# Altium schematic sheet Drone_Remote_Schematic.SchDoc
size A
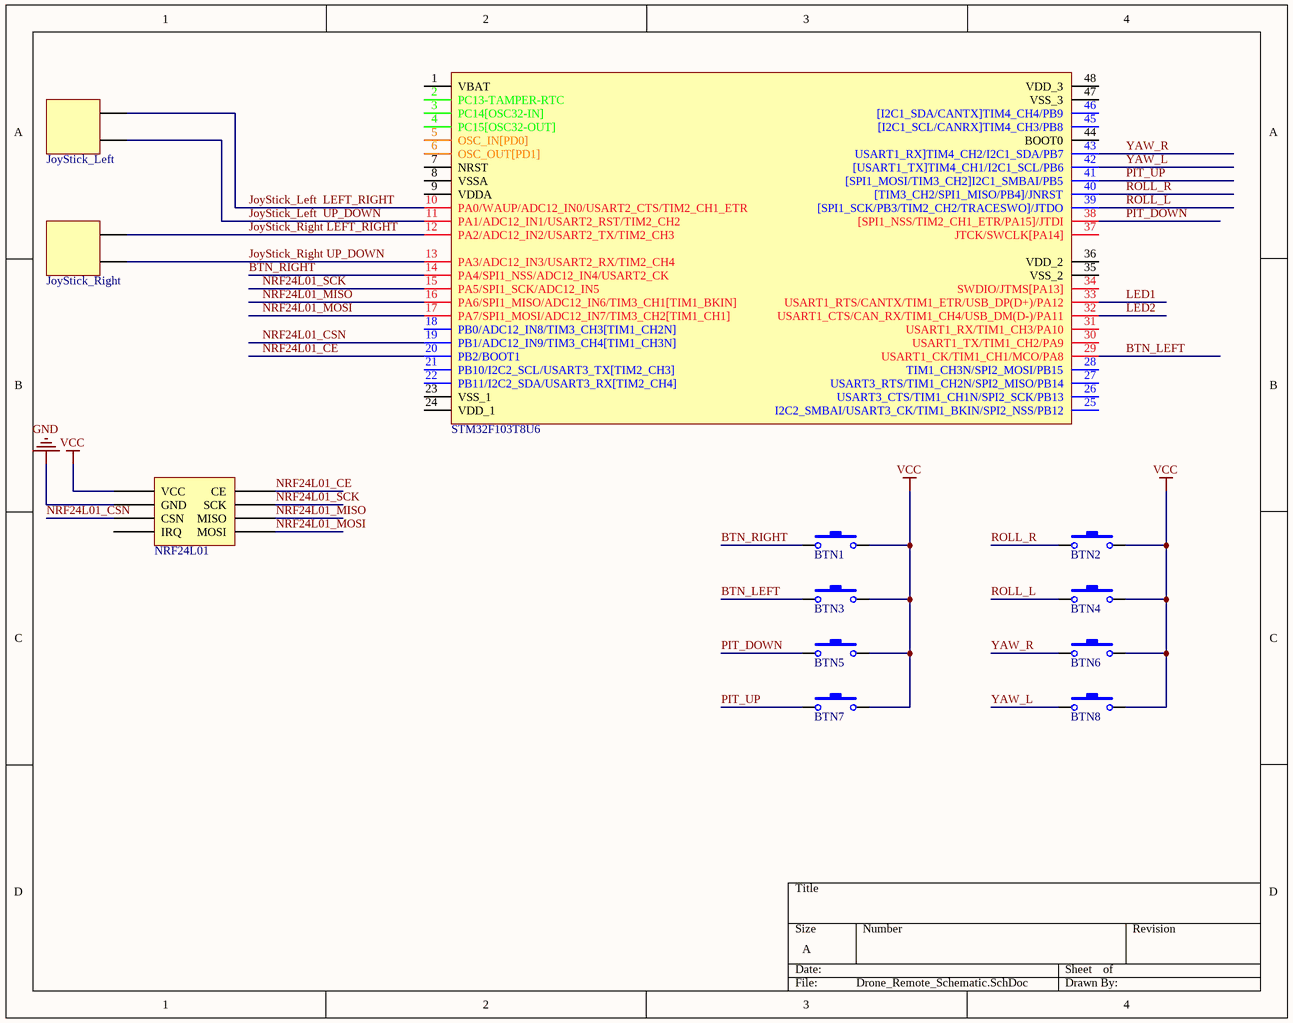
[diagram p0: Drone_Remote_Schematic.SchDoc]

## Parts
*1  JoyStick_Left
*2  JoyStick_Right
*NRF1  NRF24L01
BTN1  EVQ-21307K  (value not drawn)
BTN2  EVQ-21307K  (value not drawn)
BTN3  EVQ-21307K  (value not drawn)
BTN4  EVQ-21307K  (value not drawn)
BTN5  EVQ-21307K  (value not drawn)
BTN6  EVQ-21307K  (value not drawn)
BTN7  EVQ-21307K  (value not drawn)
BTN8  EVQ-21307K  (value not drawn)
STM32F103T8U6  MCU_STM32F103C8T6  (value not drawn)

## Nets
GND: *NRF1.23(GND)
VCC: *NRF1.22(VCC) BTN1.2 BTN2.2 BTN3.2 BTN4.2 BTN5.2 BTN6.2 BTN7.2 BTN8.2
BTN_LEFT: BTN3.1 STM32F103T8U6.29(USART1_CK/TIM1_CH1/MCO/PA8)
BTN_RIGHT: BTN1.1 STM32F103T8U6.14(PA4/SPI1_NSS/ADC12_IN4/USART2_CK)
JoyStick_Left  LEFT_RIGHT: *1.39 STM32F103T8U6.10(PA0/WAUP/ADC12_IN0/USART2_CTS/TIM2_CH1_ETR)
JoyStick_Left  UP_DOWN: *1.40 STM32F103T8U6.11(PA1/ADC12_IN1/USART2_RST/TIM2_CH2)
JoyStick_Right LEFT_RIGHT: *2.39 STM32F103T8U6.12(PA2/ADC12_IN2/USART2_TX/TIM2_CH3)
JoyStick_Right UP_DOWN: *2.40 STM32F103T8U6.13(PA3/ADC12_IN3/USART2_RX/TIM2_CH4)
LED1: STM32F103T8U6.33(USART1_RTS/CANTX/TIM1_ETR/USB_DP(D+)/PA12)
LED2: STM32F103T8U6.32(USART1_CTS/CAN_RX/TIM1_CH4/USB_DM(D-)/PA11)
NRF24L01_CE: *NRF1.18(CE) STM32F103T8U6.20(PB2/BOOT1)
NRF24L01_CSN: *NRF1.24(CSN) STM32F103T8U6.19(PB1/ADC12_IN9/TIM3_CH4[TIM1_CH3N])
NRF24L01_MISO: *NRF1.20(MISO) STM32F103T8U6.16(PA6/SPI1_MISO/ADC12_IN6/TIM3_CH1[TIM1_BKIN])
NRF24L01_MOSI: *NRF1.21(MOSI) STM32F103T8U6.17(PA7/SPI1_MOSI/ADC12_IN7/TIM3_CH2[TIM1_CH1])
NRF24L01_SCK: *NRF1.19(SCK) STM32F103T8U6.15(PA5/SPI1_SCK/ADC12_IN5)
PIT_DOWN: BTN5.1 STM32F103T8U6.38([SPI1_NSS/TIM2_CH1_ETR/PA15]/JTDI)
PIT_UP: BTN7.1 STM32F103T8U6.41([SPI1_MOSI/TIM3_CH2]I2C1_SMBAI/PB5)
ROLL_L: BTN4.1 STM32F103T8U6.39([SPI1_SCK/PB3/TIM2_CH2/TRACESWO]/JTDO)
ROLL_R: BTN2.1 STM32F103T8U6.40([TIM3_CH2/SPI1_MISO/PB4]/JNRST)
YAW_L: BTN8.1 STM32F103T8U6.42([USART1_TX]TIM4_CH1/I2C1_SCL/PB6)
YAW_R: BTN6.1 STM32F103T8U6.43(USART1_RX]TIM4_CH2/I2C1_SDA/PB7)

Not connected (* = marked no-connect by the designer): *NRF1 25(IRQ); STM32F103T8U6 1(VBAT) 2(PC13-TAMPER-RTC) 3(PC14[OSC32-IN]) 4(PC15[OSC32-OUT]) 5(OSC_IN[PD0]) 6(OSC_OUT[PD1]) 7(NRST) 8(VSSA) 9(VDDA) 18(PB0/ADC12_IN8/TIM3_CH3[TIM1_CH2N]) 21(PB10/I2C2_SCL/USART3_TX[TIM2_CH3]) 22(PB11/I2C2_SDA/USART3_RX[TIM2_CH4]) 23(VSS_1) 24(VDD_1) 25(I2C2_SMBAI/USART3_CK/TIM1_BKIN/SPI2_NSS/PB12) 26(USART3_CTS/TIM1_CH1N/SPI2_SCK/PB13) 27(USART3_RTS/TIM1_CH2N/SPI2_MISO/PB14) 28(TIM1_CH3N/SPI2_MOSI/PB15) 30(USART1_TX/TIM1_CH2/PA9) 31(USART1_RX/TIM1_CH3/PA10) 34(SWDIO/JTMS[PA13]) 35(VSS_2) 36(VDD_2) 37(JTCK/SWCLK[PA14]) 44(BOOT0) 45([I2C1_SCL/CANRX]TIM4_CH3/PB8) 46([I2C1_SDA/CANTX]TIM4_CH4/PB9) 47(VSS_3) 48(VDD_3)

## Library data of the parts
*1 *2 = JoyStick
BTN1-BTN8 = BTN_2_Pin: PANASONIC   EVQ-21307K   SWITCH, TACTILE, SPST-NO, 20mA, 15VDC; Actuator Color: Black; Maximum DC Voltage Rating: 15 V; Pole Throw Configuration: SPST; Switch Configuration: N.O.; Illumination Type: N/R; Ground Terminal: No; Electrical Life: 100000 Cycles; Body Orientation: Straight; Actuator Length: 3.6 mm; Maximum Contact Resistance: 50 mOhm; Operating Force: 1 N; Actuator Style: Round Button; Dielectric Strength: 250 VAC; Contact Rating @ Voltage: 0.02@15VDC A; COO: MY; Manufacturer: Panasonic; Manufacturer Part Number: EVQ-21307K; Part No: EVQ-21307K; RoHS: Yes; Supplier Standard Pack: 1,000; Type: Light Touch; Maximum AC Voltage Rating: N/A; Family: EVQ2; Contact Material: N/A; Seal Description: N/A; Mechanical Life: N/A; Packaging: Radial Tape and Reel; Contact Plating: N/A; Housing Material: N/A; Product Weight: N/A; Base Material: N/A; Mounting: Through Hole,PC Pins; Seal Location: N/A; Minimum Insulation Resistance: 50 MOhm; Operating Temperature: -20 to 70 C; Dimension: 6 x 6 x 7 mm; HTS: 8536509020; ECCN: EAR99; ComponentLink1URL: https://industrial.panasonic.com/ac/e_download/control/switch/light-touch/catalog/sw_lt_eng_5n_2r.pdf?src-supplier=Digi-Key; ComponentLink1Description: https://industrial.panasonic.com/ac/e_download/control/switch/light-touch/catalog/sw_lt_eng_5n_2r.pdf?src-supplier=Digi-Key; ComponentLink2URL: http://industrial.panasonic.com/www-data/pdf/ATK0000/ATK0000CE33.pdf?src-supplier=Future+Electronics; ComponentLink2Description: http://industrial.panasonic.com/www-data/pdf/ATK0000/ATK0000CE33.pdf?src-supplier=Future+Electronics; ComponentLink3URL: https://www.alliedelec.com/m/d/c6165424a4b5cbcf56af329b1c3386ad.pdf?src-supplier=Allied+Electronics; ComponentLink3Description: https://www.alliedelec.com/m/d/c6165424a4b5cbcf56af329b1c3386ad.pdf?src-supplier=Allied+Electronics; ComponentLink4URL: http://industrial.panasonic.com/www-data/pdf/ATK0000/ATK0000CE33.pdf?src-supplier=Avnet; ComponentLink4Description: http://industrial.panasonic.com/www-data/pdf/ATK0000/ATK0000CE33.pdf?src-supplier=Avnet; Supplier 1: Digi-Key; Supplier Part Number 1: P12218SCT-ND
STM32F103T8U6 = MCU_STM32F103C8T6: IC MCU 32BIT 64KB FLASH 48LQFP;  ARM® Cortex®-M3 STM32 F1 Microcontroller IC 32-Bit 72MHz 64KB (64K x 8) FLASH; Manufacturer: STMicroelectronics; Connectivity: CAN, I²C, IrDA, LIN, SPI, UART/USART, USB; Peripherals: DMA, Motor Control PWM, PDR, POR, PVD, PWM, Temp Sensor, WDT; Number of I/O: 37; RAM Size: 20K x 8; Voltage - Supply (Vcc/Vdd): 2 V ~ 3.6 V; Data Converters: A/D 10x12b; Oscillator Type: Internal; Supplier 1: Digi-Key; Manufacturer Part Number: STM32F103C8T6; RoHS: RoHS Compliant; Category: Integrated Circuits (ICs); Stock 1: 3485; Pricing 1: 1=6.06, 10=5.438, 100=4.4558, 500=3.7931, 1000=3.199 (USD); Packaging: Tray; Part Status: Active; Core Processor: ARM® Cortex®-M3; Core Size: 32-Bit; Speed: 72MHz; Program Memory Size: 64KB (64K x 8); Program Memory Type: FLASH; EEPROM Size: -; Operating Temperature: -40°C ~ 85°C (TA); Package / Case: 48-LQFP; ComponentLink1URL: http://media.digikey.com/pdf/Data%20Sheets/ST%20Microelectronics%20PDFS/STM32F103x8,B.pdf; ComponentLink1Description: http://media.digikey.com/pdf/Data%20Sheets/ST%20Microelectronics%20PDFS/STM32F103x8,B.pdf; Supplier Part Number 1: 497-6063-ND